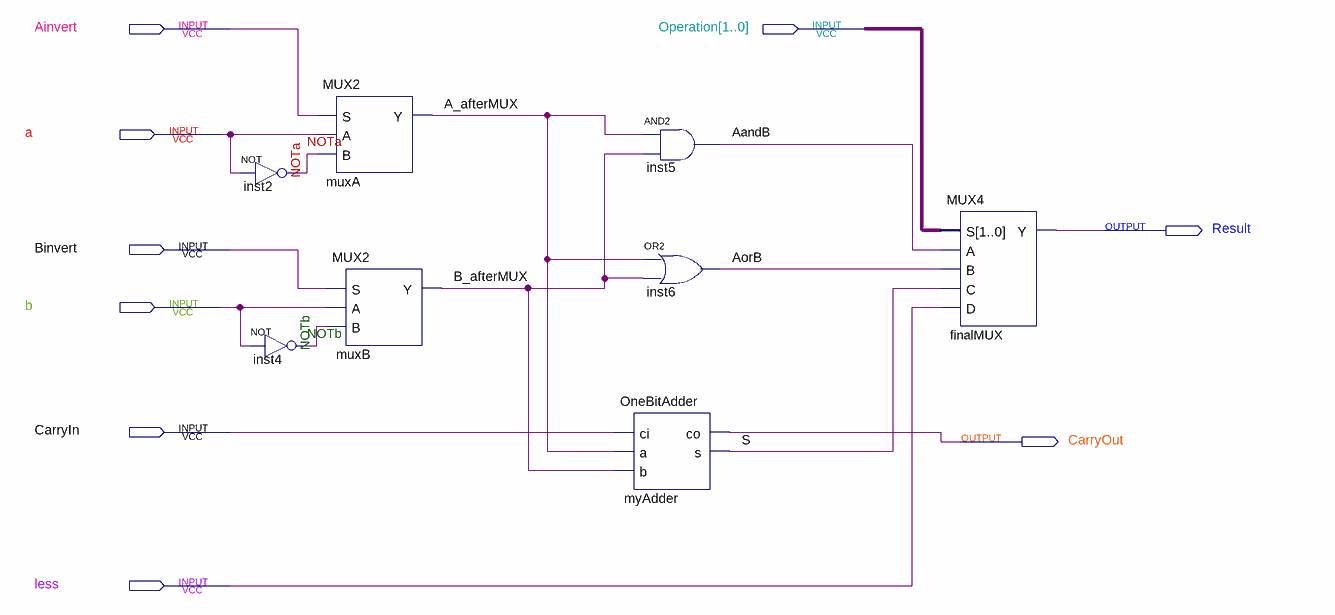
[diagram p0: schematic sheet]
// Quartus schematic ALUBits0To30.bdf as structural Verilog: 8 symbols, 9 pins
module ALUBits0To30 (
  input  Ainvert,
  input  [1:0] Operation,
  input  a,
  input  Binvert,
  input  b,
  input  CarryIn,
  input  less,
  output Result,
  output CarryOut
);

  wire A_afterMUX, AandB, AorB, B_afterMUX, NOTa, NOTb, S;

  not inst2 (NOTa, a);
  not inst4 (NOTb, b);
  MUX2 muxA (.S(Ainvert), .A(a), .B(NOTa), .Y(A_afterMUX));
  MUX2 muxB (.S(Binvert), .A(b), .B(NOTb), .Y(B_afterMUX));
  and inst5 (AandB, A_afterMUX, B_afterMUX);
  or inst6 (AorB, A_afterMUX, B_afterMUX);
  OneBitAdder myAdder (.ci(CarryIn), .a(A_afterMUX), .b(B_afterMUX), .co(CarryOut), .s(S));
  MUX4 finalMUX (.S(Operation), .A(AandB), .B(AorB), .C(S), .D(less), .Y(Result));
endmodule
